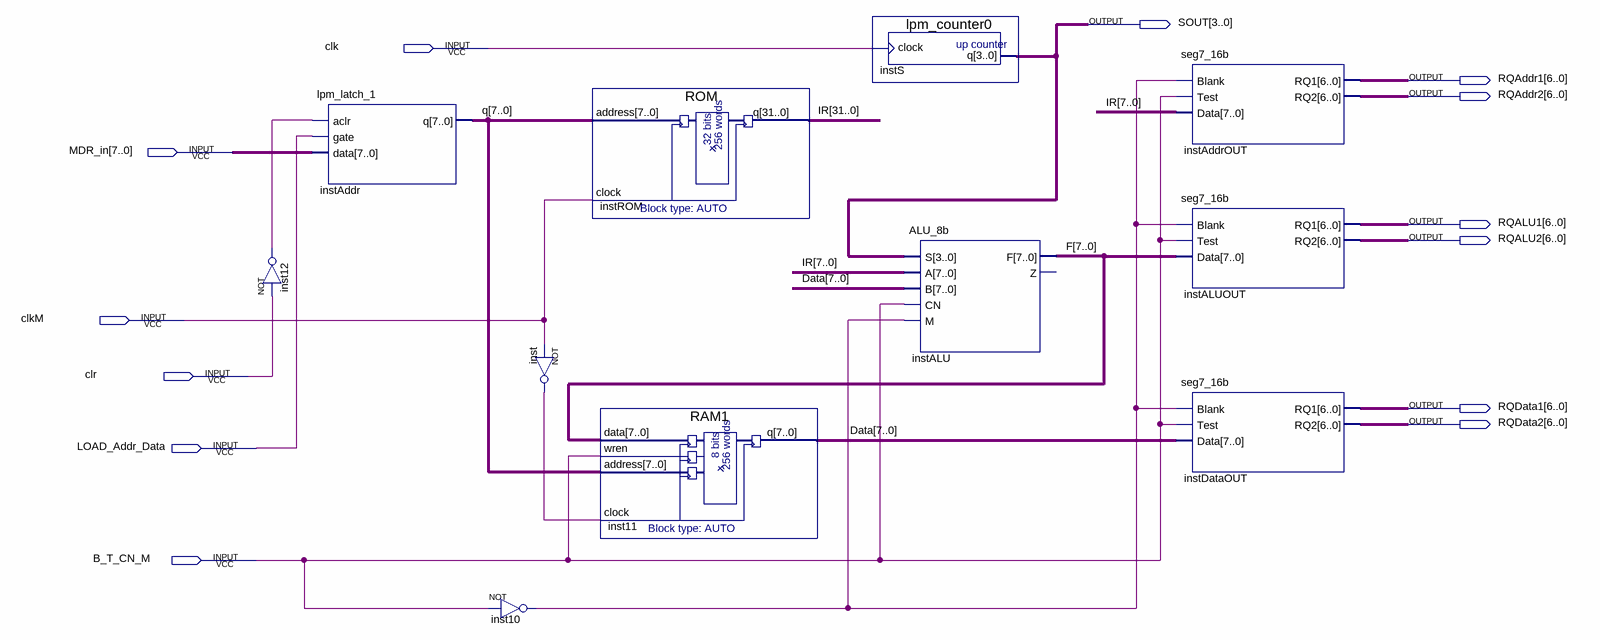
[diagram p0: schematic sheet]
// Quartus schematic ALU_RAM.bdf as structural Verilog: 11 symbols, 13 pins
module ALU_RAM (
  input  clk,
  input  [7:0] MDR_in,
  input  clkM,
  input  clr,
  input  LOAD_Addr_Data,
  input  B_T_CN_M,
  output [3:0] SOUT,
  output [6:0] RQAddr1,
  output [6:0] RQAddr2,
  output [6:0] RQALU1,
  output [6:0] RQALU2,
  output [6:0] RQData1,
  output [6:0] RQData2
);

  wire inst10_out, inst12_out, inst_out;
  wire [7:0] Data, F, q;
  wire [31:0] IR;

  not inst12 (inst12_out, clr);
  lpm_latch_1 instAddr (.aclr(inst12_out), .gate(LOAD_Addr_Data), .data(MDR_in), .q(q));
  not inst10 (inst10_out, B_T_CN_M);
  not inst (inst_out, clkM);
  ROM instROM (.address(q), .clock(clkM), .q(IR));
  RAM1 inst11 (.data(F), .wren(B_T_CN_M), .address(q), .clock(inst_out), .q(Data));
  lpm_counter0 instS (.clock(clk), .q(SOUT));
  ALU_8b instALU (.S(SOUT), .A(IR[7:0]), .B(Data), .CN(B_T_CN_M), .M(inst10_out), .F(F));  // open: Z
  seg7_16b instAddrOUT (.Blank(inst10_out), .Test(B_T_CN_M), .Data(IR[7:0]), .RQ1(RQAddr1), .RQ2(RQAddr2));
  seg7_16b instALUOUT (.Blank(inst10_out), .Test(B_T_CN_M), .Data(F), .RQ1(RQALU1), .RQ2(RQALU2));
  seg7_16b instDataOUT (.Blank(inst10_out), .Test(B_T_CN_M), .Data(Data), .RQ1(RQData1), .RQ2(RQData2));
endmodule
